# EasyEDA Pro project source.epro, schematic Active_Acoustic_Impedance_Controller_C11_35
Board Name: Active_Acoustic_Impedance_Controller_C11_35; Create Date: 2026-06-30; Page Name: Active_Acoustic_Impedance_Controller_C11_35; Project Name: 正弦电阻V4; Schematic Name: Active_Acoustic_Impedance_Controller_C11_35; Update Date: 2026-07-03; File: Active_Acoustic_Impedance_Controller_C11_35; Id: /; Sheet: /
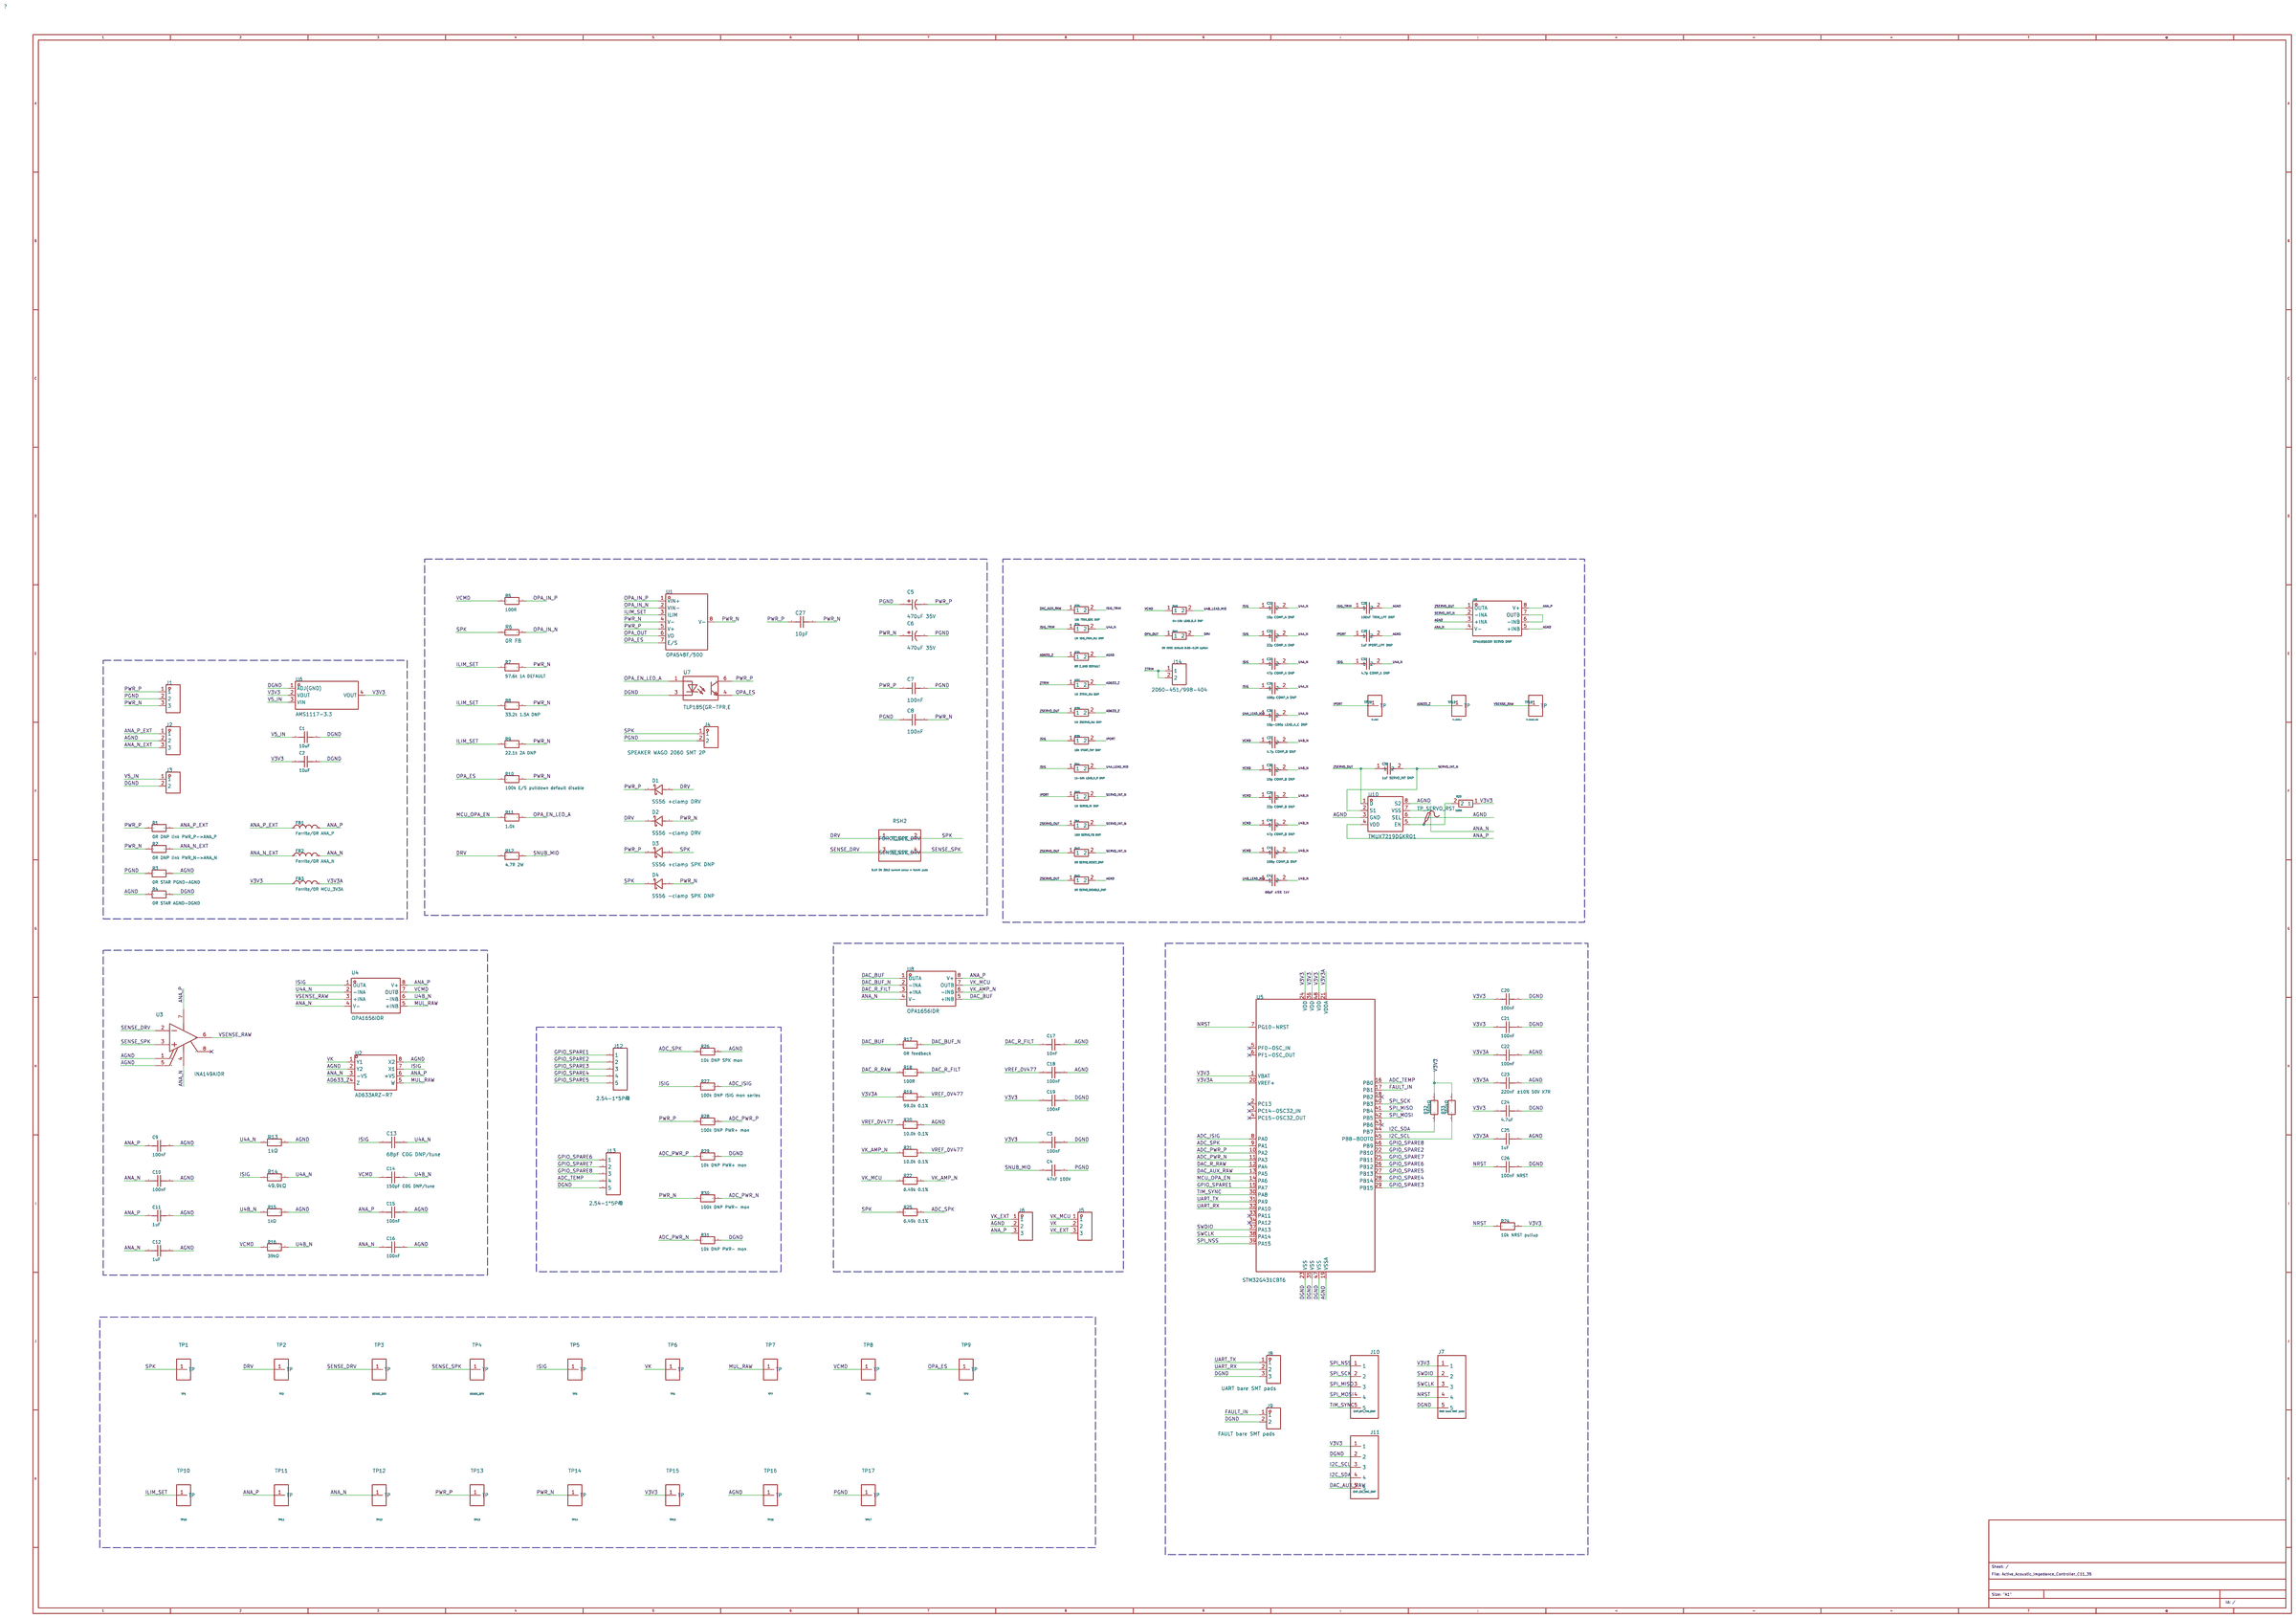
[diagram p0: schematic sheet]

## Parts
C1  10uF  [C0805]
C2  10uF  [C0805]
C3  100nF  [C0805]
C4  47nF 100V  [C0805]
C5  470uF 35V  [CAP-SMD_BD10.0-L10.3-W10.3-LS11.3-FD]
C6  470uF 35V  [CAP-SMD_BD10.0-L10.3-W10.3-LS11.3-FD]
C7  100nF  [C0805]
C8  100nF  [C0805]
C9  100nF  [C0805]
C10  100nF  [C0805]
C11  1uF  [C0805]
C12  1uF  [C0805]
C13  68pF C0G DNP/tune  [C0805]  (no BOM)
C14  150pF C0G DNP/tune  [C0805]  (no BOM)
C15  100nF  [C0805]
C16  100nF  [C0805]
C17  10nF  [C0805]
C18  100nF  [C0805]
C19  100nF  [C0805]
C20  100nF  [C0805]
C21  100nF  [C0805]
C22  100nF  [C0805]
C23  220nF ±10% 50V X7R  [C0805]
C24  4.7uF  [C0805]
C25  1uF  [C0805]
C26  100nF NRST  [C0805]
C27  10pF  [C0805]
C28  100nF TRIM_LPF DNP  [C0805]
C29  1uF IPORT_LPF DNP  [C0805]
C30  1uF SERVO_INT DNP  [C0805]
C31  4.7p COMP_A DNP  [C0805]
C32  10p COMP_A DNP  [C0805]
C33  22p COMP_A DNP  [C0805]
C34  47p COMP_A DNP  [C0805]
C35  100p COMP_A DNP  [C0805]
C36  10p-100p LEAD_A_C DNP  [C0805]
C37  4.7p COMP_B DNP  [C0805]
C38  10p COMP_B DNP  [C0805]
C39  22p COMP_B DNP  [C0805]
C40  47p COMP_B DNP  [C0805]
C41  100p COMP_B DNP  [C0805]
C42  10p-100p LEAD_B_C DNP  [C0805]
D1  SS56 +clamp DRV  [SMB_L4.3-W3.6-LS5.4-RD]
D2  SS56 -clamp DRV  [SMB_L4.3-W3.6-LS5.4-RD]
D3  SS56 +clamp SPK DNP  [SMB_L4.3-W3.6-LS5.4-RD]  (no BOM)
D4  SS56 -clamp SPK DNP  [SMB_L4.3-W3.6-LS5.4-RD]  (no BOM)
FB1  Ferrite/0R ANA_P  [L0805]
FB2  Ferrite/0R ANA_N  [L0805]
FB3  Ferrite/0R MCU_3V3A  [L0805]
J1  2060-453/998-404  [CONN-SMD_2060-453]
J2  2060-453/998-404  [CONN-SMD_2060-453]
J3  2060-452/998-404  [CONN-SMD_2060-452]
J4  SPEAKER WAGO 2060 SMT 2P  [CONN-SMD_2060-452]
J5  2060-453/998-404  [CONN-SMD_2060-453]
J6  2060-453/998-404  [CONN-SMD_2060-453]
J7  SWD bare SMT pads  [AAI_C11_35_LOCAL_Footprints:AAI_PinHeader_1x05_P1_27mm_Vertical]  (no BOM)
J8  UART bare SMT pads  [CONN-SMD_2060-453]
J9  FAULT bare SMT pads  [CONN-SMD_2060-452]
J10  EXP_SPI_TIM_DNP  [AAI_C11_35_LOCAL_Footprints:AAI_PinHeader_1x05_P2_54mm_Vertical]  (no BOM)
J11  EXP_I2C_DAC_DNP  [AAI_C11_35_LOCAL_Footprints:AAI_PinHeader_1x05_P2_54mm_Vertical]  (no BOM)
J12  2.54-1*5P母  [HDR-TH_5P-P2.54-V-F]
J13  2.54-1*5P母  [HDR-TH_5P-P2.54-V-F]
J14  2060-451/998-404  [CONN-SMD_L12.7-W3.9_2060-451-998-404]
R1  0R DNP link PWR_P->ANA_P  [R0805]  (no BOM)
R2  0R DNP link PWR_N->ANA_N  [R0805]  (no BOM)
R3  0R STAR PGND-AGND  [R0805]
R4  0R STAR AGND-DGND  [R0805]
R5  100R  [R0805]
R6  0R FB  [R0805]
R7  57.6k 1A DEFAULT  [R0805]
R8  33.2k 1.5A DNP  [R0805]  (no BOM)
R9  22.1k 2A DNP  [R0805]  (no BOM)
R10  100k E/S pulldown default disable  [R0805]
R11  1.0k  [R0805]
R12  4.7R 2W  [R0805]
R13  1kΩ  [R0805]
R14  49.9kΩ  [R0805]
R15  1kΩ  [R0805]
R16  39kΩ  [R0805]
R17  0R feedback  [R0805]
R18  100R  [R0805]
R19  59.0k 0.1%  [R0805]
R20  10.0k 0.1%  [R0805]
R21  10.0k 0.1%  [R0805]
R22  6.49k 0.1%  [R0805]
R23  100K  [R0805]
R24  10k NRST pullup  [R0805]
R25  6.49k 0.1%  [R0805]  (no BOM)
R26  10k DNP SPK mon  [R0805]  (no BOM)
R27  100k DNP ISIG mon series  [R0805]  (no BOM)
R28  100k DNP PWR+ mon  [R0805]  (no BOM)
R29  10k DNP PWR+ mon  [R0805]  (no BOM)
R30  100k DNP PWR- mon  [R0805]  (no BOM)
R31  10k DNP PWR- mon  [R0805]
R32  360kΩ  [R0805]  (no BOM)
R33  360kΩ  [R0805]  (no BOM)
R34  1M ISIG_TRIM_INJ DNP  [R0805]
R35  10k TRIM_SRC DNP  [R0805]
R36  0R Z_GND DEFAULT  [R0805]
R37  1M ZTRIM_INJ DNP  [R0805]
R38  1M ZSERVO_INJ DNP  [R0805]
R39  10k IPORT_TAP DNP  [R0805]
R40  1M SERVO_IN DNP  [R0805]
R41  10M SERVO_FB DNP  [R0805]
R42  0R SERVO_RESET_DNP  [R0805]
R43  0R SERVO_DISABLE_DNP  [R0805]
R44  1k-10k LEAD_A_R DNP  [R0805]
R45  1k-10k LEAD_B_R DNP  [R0805]
R46  0R RISO default 0.05-0.2R option  [R0805]
RSH2  0.1R 3W 2512 current sense + Kelvin pads  [AAI_C11_35_LOCAL_Footprints:AAI_SHUNT_4T_3920_Kelvin]
TP1  TP1  [AAI_C11_35_LOCAL_Footprints:AAI_TestPoint_THTPad_D1_5mm_Drill0_7mm]  (no BOM)
TP2  TP2  [AAI_C11_35_LOCAL_Footprints:AAI_TestPoint_THTPad_D1_5mm_Drill0_7mm]  (no BOM)
TP3  SENSE_DRV  [AAI_C11_35_LOCAL_Footprints:AAI_TestPoint_THTPad_D1_5mm_Drill0_7mm]  (no BOM)
TP4  SENSE_SPK  [AAI_C11_35_LOCAL_Footprints:AAI_TestPoint_THTPad_D1_5mm_Drill0_7mm]  (no BOM)
TP5  TP5  [AAI_C11_35_LOCAL_Footprints:AAI_TestPoint_THTPad_D1_5mm_Drill0_7mm]  (no BOM)
TP6  TP6  [AAI_C11_35_LOCAL_Footprints:AAI_TestPoint_THTPad_D1_5mm_Drill0_7mm]  (no BOM)
TP7  TP7  [AAI_C11_35_LOCAL_Footprints:AAI_TestPoint_THTPad_D1_5mm_Drill0_7mm]  (no BOM)
TP8  TP8  [AAI_C11_35_LOCAL_Footprints:AAI_TestPoint_THTPad_D1_5mm_Drill0_7mm]  (no BOM)
TP9  TP9  [AAI_C11_35_LOCAL_Footprints:AAI_TestPoint_THTPad_D1_5mm_Drill0_7mm]  (no BOM)
TP10  TP10  [AAI_C11_35_LOCAL_Footprints:AAI_TestPoint_THTPad_D1_5mm_Drill0_7mm]  (no BOM)
TP11  TP11  [AAI_C11_35_LOCAL_Footprints:AAI_TestPoint_THTPad_D1_5mm_Drill0_7mm]  (no BOM)
TP12  TP12  [AAI_C11_35_LOCAL_Footprints:AAI_TestPoint_THTPad_D1_5mm_Drill0_7mm]  (no BOM)
TP13  TP13  [AAI_C11_35_LOCAL_Footprints:AAI_TestPoint_THTPad_D1_5mm_Drill0_7mm]  (no BOM)
TP14  TP14  [AAI_C11_35_LOCAL_Footprints:AAI_TestPoint_THTPad_D1_5mm_Drill0_7mm]  (no BOM)
TP15  TP15  [AAI_C11_35_LOCAL_Footprints:AAI_TestPoint_THTPad_D1_5mm_Drill0_7mm]  (no BOM)
TP16  TP16  [AAI_C11_35_LOCAL_Footprints:AAI_TestPoint_THTPad_D1_5mm_Drill0_7mm]  (no BOM)
TP17  TP17  [AAI_C11_35_LOCAL_Footprints:AAI_TestPoint_THTPad_D1_5mm_Drill0_7mm]  (no BOM)
TP18  TP_VSENSE_RAW  [AAI_C11_35_LOCAL_Footprints:AAI_TestPoint_THTPad_D1_5mm_Drill0_7mm]  (no BOM)
TP19  TP_AD633_Z  [AAI_C11_35_LOCAL_Footprints:AAI_TestPoint_THTPad_D1_5mm_Drill0_7mm]  (no BOM)
TP20  TP_IPORT  [AAI_C11_35_LOCAL_Footprints:AAI_TestPoint_THTPad_D1_5mm_Drill0_7mm]  (no BOM)
TP_SERVO_RST  -  [Test-Point-0.5mm]
U1  OPA548F/500  [TO-263-7_L10.2-W10.4-P1.27-LS14.4-TL]
U2  AD633ARZ-R7  [SOIC-8_L4.9-W3.9-P1.27-LS6.0-BL]
U3  INA149AIDR  [SOIC-8_L4.9-W3.9-P1.27-LS6.0-BL]
U4  OPA1656IDR  [SOIC-8_L4.9-W3.9-P1.27-LS6.0-BL]
U5  STM32G431CBT6  [LQFP-48_L7.0-W7.0-P0.50-LS9.0-BL]
U6  AMS1117-3.3  [SOT-223-3_L6.5-W3.4-P2.30-LS7.0-BR]
U7  TLP185(GR-TPR,E  [SOP-6_4P-L3.7-W4.6-P2.54-LS7.0-BL]
U8  OPA1656IDR  [SOIC-8_L4.9-W3.9-P1.27-LS6.0-BL]
U9  OPA1656IDR SERVO DNP  [SOIC-8_L4.9-W3.9-P1.27-LS6.0-BL]  (no BOM)
U10  TMUX7219DGKRQ1  [VSSOP-8_L3.0-W3.0-P0.65-LS4.9-BL]

## Library data of the parts
C1 C2 = AC0805KKX5R9BB225: 容值:2.2uF;精度:±10%;额定电压:50V;温度系数:X5R;; LCSC Part Name: 2.2uF ±10% 50V; Supplier Part: C3849516; Manufacturer: YAGEO(国巨); Supplier Footprint: 0805; JLCPCB Part Class: 扩展库; Datasheet: https://item.szlcsc.com/datasheet/AC0805KKX5R9BB225/4418002.html; Supplier: LCSC; Tolerance: ±10%; Voltage Rating: 50V; Temperature Coefficient: X5R
C3 C4 C17-C19 = CL21A106KAYNNNG: 容值:10uF;精度:±10%;额定电压:25V;温度系数:X5R;; LCSC Part Name: 10uF ±10% 25V; Supplier Part: C318691; Manufacturer: SAMSUNG(三星); Supplier Footprint: 0805; JLCPCB Part Class: 扩展库; Supplier: LCSC; Tolerance: ±10%; Voltage Rating: 25V; Temperature Coefficient: X5R
C5 C6 = XT470UF35V90RV0080: 容值:470uF;精度:±20%;额定电压:35V;纹波电流:310mA@120Hz;等效串联电阻(ESR):-;; LCSC Part Name: 470uF ±20% 35V; Supplier Part: C2992611; Manufacturer: KNSCHA(科尼盛); Supplier Footprint: SMD,D10xL10.5mm; JLCPCB Part Class: 扩展库; Datasheet: https://item.szlcsc.com/datasheet/XT470UF35V90RV0080/3457671.html; Supplier: LCSC; Tolerance: ±20%; Voltage Rating: 35V; Ripple Current: 310mA@120Hz; Diameter: 10mm; Height - Seated (Max): 10.5mm; Lifetime: 2000hrs@105℃; Operating Temperature: -55℃~+105℃
C7 C8 = CC0805KRX7R9BB104: 容值:100nF;精度:±10%;额定电压:50V;温度系数:X7R;; LCSC Part Name: 100nF ±10% 50V; Supplier Part: C49678; Manufacturer: YAGEO(国巨); Supplier Footprint: 0805; JLCPCB Part Class: 基础库; Datasheet: https://item.szlcsc.com/datasheet/CC0805KRX7R9BB104/50686.html; Supplier: LCSC; Tolerance: ±10%; Voltage Rating: 50V; Temperature Coefficient: X7R
C9 C10 C14-C16 = CSA0805X7R104K201MT: 容值:100nF;精度:±10%;额定电压:200V;温度系数:X7R;; LCSC Part Name: 100nF ±10% 200V; Supplier Part: C54177994; Manufacturer: HRE(芯声); Supplier Footprint: 0805; JLCPCB Part Class: 扩展库; Datasheet: https://item.szlcsc.com/datasheet/CSA0805X7R104K201MT/57424607.html; Supplier: LCSC; Tolerance: ±10%; Voltage Rating: 200V; Temperature Coefficient: X7R
C11 C12 = C0805Y5V250-105ZNE: 容值:1uF;精度:-20%~+80%;额定电压:25V;温度系数:Y5V;; LCSC Part Name: 1uF -20%~+80% 25V; Supplier Part: C3907177; Manufacturer: Venkel; Supplier Footprint: 0805; JLCPCB Part Class: 扩展库; Datasheet: https://item.szlcsc.com/datasheet/C0805Y5V250-105ZNE/4475709.html; Supplier: LCSC; Tolerance: -20%~+80%; Voltage Rating: 25V; Temperature Coefficient: Y5V
C13 = FV21N680J102ECG: 容值:68pF;精度:±5%;额定电压:1kV;温度系数:C0G;; LCSC Part Name: 68pF ±5% 1kV; Supplier Part: C565680; Manufacturer: PSA(信昌电陶); Supplier Footprint: 0805; JLCPCB Part Class: 扩展库; Datasheet: https://item.szlcsc.com/datasheet/FV21N680J102ECG/591162.html; Supplier: LCSC; Tolerance: ±5%; Voltage Rating: 1kV; Temperature Coefficient: C0G
C20-C26 = CL21B224KCQVPNE: 容值:220nF;精度:±10%;额定电压:100V;温度系数:X7R;; LCSC Part Name: 220nF ±10% 100V; Supplier Part: C2976447; Manufacturer: SAMSUNG(三星); Supplier Footprint: 0805; JLCPCB Part Class: 扩展库; Datasheet: https://item.szlcsc.com/datasheet/CL21B224KCQVPNE/3382911.html; Supplier: LCSC; Tolerance: ±10%; Voltage Rating: 100V; Temperature Coefficient: X7R
C27 = 0805CG100J501NT: 容值:10pF;精度:±5%;额定电压:500V;温度系数:C0G;; LCSC Part Name: 10pF ±5% 500V; Supplier Part: C49307532; Manufacturer: FH(风华); Supplier Footprint: 0805; JLCPCB Part Class: 扩展库; Datasheet: https://item.szlcsc.com/datasheet/0805CG100J501NT/51771081.html; Supplier: LCSC; Tolerance: ±5%; Voltage Rating: 500V; Temperature Coefficient: C0G
C28-C42 = ProPrj_正弦电-easyedapro_FV21N680J102ECG: UserDocLink: https://item.szlcsc.com/datasheet/FV21N680J102ECG/591162.html; Manufacturer Part: FV21N680J102ECG; Manufacturer: PSA(信昌电陶); Supplier Part: C565680; Supplier: LCSC; LCSC Part Name: 68pF ±5% 1kV
D1-D4 = SS56: Supplier Part: C9900018665; Supplier Footprint: SMB; JLCPCB Part Class: 扩展库; Supplier: LCSC
FB1-FB3 = MLB2012F-151T: 阻抗@频率:150Ω@100MHz;误差:±25%;直流电阻(DCR):200mΩ;; LCSC Part Name: 单路 0805磁珠 阻抗150Ω@100MHz; Supplier Part: C2844589; Manufacturer: MetalLions(美铼); Supplier Footprint: 0805; JLCPCB Part Class: 扩展库; Datasheet: https://item.szlcsc.com/datasheet/MLB2012F-151T/3035854.html; Supplier: LCSC; Impedance @ Frequency: 150Ω@100MHz; Tolerance: ±25%; DC Resistance(DCR): 200mΩ; Current Rating: 400mA; Number of Circuits: 1; Operating Temperature: -55℃~+125℃
J1 J2 J5 J6 J8 = 2060-453/998-404: 结构:1x3P;间距:4mm;颜色:白色;安装方式:-;总PIN数:3P;每排PIN数:3;排数:1;额定电流:9A;额定电压:320V;线规 - AWG:18~24;线规 - 平方毫米:-;工作温度:-60℃~+105℃;; LCSC Part Name: 1x3P 4mm 每排P数:3 排数:1; Supplier Part: C2765056; Manufacturer: WAGO(万可); Supplier Footprint: SMD,P=4mm; JLCPCB Part Class: 扩展库; Datasheet: https://item.szlcsc.com/datasheet/2060-453%252F998-404/2901157.html; Supplier: LCSC; Number of Positions or Pins: 1x3P; Pitch: 4mm; Color: 白色; Number of Pins: 3P; Number of PINs Per Row: 3; Number of Rows: 1; Current Rating: 9A; Voltage Rating (Max): 320V; Wire Gauge - AWG: 18~24; Operating Temperature: -60℃~+105℃
J3 J4 J9 = 2060-452/998-404: 结构:1x2P;间距:4mm;颜色:白色;安装方式:-;总PIN数:2P;每排PIN数:2;排数:1;额定电流:9A;额定电压:320V;线规 - AWG:18~24;线规 - 平方毫米:-;工作温度:-60℃~+105℃;; LCSC Part Name: 1x2P 4mm 每排P数:2 排数:1; Supplier Part: C2765055; Manufacturer: WAGO(万可); Supplier Footprint: SMD,P=4mm; JLCPCB Part Class: 扩展库; Datasheet: https://item.szlcsc.com/datasheet/2060-452%252F998-404/2901156.html; Supplier: LCSC; Number of Positions or Pins: 1x2P; Pitch: 4mm; Color: 白色; Number of Pins: 2P; Number of PINs Per Row: 2; Number of Rows: 1; Current Rating: 9A; Voltage Rating (Max): 320V; Wire Gauge - AWG: 18~24; Operating Temperature: -60℃~+105℃
J7 = AAI_CONN_01X05: Mount: PAD; JLCPCB_Assembly: NO; Assembly_Risk: HAND; Assembly_Note: Excluded from JLC SMT BOM/CPL; hand solder.
J10 J11 = AAI_CONN_01X05
J12 J13 = 2.54-1*5P母: 插孔结构:1x5P;间距:2.54mm;行距:-;圆孔/方孔:方孔;安装方式:直插;排数:单排;总孔位数:5P;额定电流:3A;插孔方向:顶部;塑高:8.5mm;触头材质:黄铜;触头镀层:金;工作温度:-55℃~+105℃;; LCSC Part Name: 1x5P 间距:2.54mm 直插; Supplier Part: C50950; Manufacturer: BOOMELE(博穆精密); Supplier Footprint: 插件,P=2.54mm; JLCPCB Part Class: 扩展库; Datasheet: https://item.szlcsc.com/datasheet/2.54-1*5P%25E6%25AF%258D/51962.html; Supplier: LCSC; Holes Structure: 1x5P; Pitch: 2.54mm; Circular Hole / Square Hole: 方孔; Mounting Type: 直插; Number of Rows: 单排; Number of Positions: 5P; Current Rating: 3A; Holes Direction: 顶部; Insulation Height: 8.5mm; Contact Material: 黄铜; Contact Plating: 金; Operating Temperature: -55℃~+105℃; PIN Length: 3.2mm
J14 = 2060-451/998-404: 结构:1x1P;间距:-;颜色:白色;安装方式:卧贴;总PIN数:1P;每排PIN数:1;排数:1;额定电流:9A;额定电压:600V;线规 - AWG:18~24;线规 - 平方毫米:0.2~0.75;工作温度:-60℃~+105℃;; LCSC Part Name: 1x1P 每排P数:1 排数:1; Supplier Part: C2765054; Manufacturer: WAGO(万可); Supplier Footprint: SMD,P=4mm; JLCPCB Part Class: Extended Part; Datasheet: https://item.szlcsc.com/datasheet/2060-451%252F998-404/2901155.html; Supplier: LCSC; Number of Positions or Pins: 1x1P; Color: 白色; Mounting Type: 卧贴; Number of Pins: 1P; Number of PINs Per Row: 1; Number of Rows: 1; Current Rating: 9A; Voltage Rating (Max): 600V; Wire Gauge - AWG: 18~24; Wire Gauge - mm2: 0.2~0.75; Operating Temperature: -60℃~+105℃
R1-R5 R7-R11 = MCU08050D1000BP100: 电阻类型:薄膜电阻;阻值:100Ω;精度:±0.1%;功率:125mW;温度系数:±25ppm/℃;; LCSC Part Name: 薄膜电阻 100Ω ±0.1% 125mW; Supplier Part: C4277626; Manufacturer: VISHAY(威世); Supplier Footprint: 0805; JLCPCB Part Class: 扩展库; Datasheet: https://item.szlcsc.com/datasheet/MCU08050D1000BP100/4848059.html; Supplier: LCSC; Type: 薄膜电阻; Tolerance: ±0.1%; Power(Watts): 125mW; Temperature Coefficient: ±25ppm/℃; Operating Temperature: -55℃~+125℃
R6 = 0805W8F0000T5E: 电阻类型:厚膜电阻;阻值:0Ω;精度:±1%;功率:125mW;工作电压:150V;温度系数:±800ppm/℃;; LCSC Part Name: 0Ω ±1% 125mW 厚膜电阻; Supplier Part: C17477; Manufacturer: UNI-ROYAL(厚声); Supplier Footprint: 0805; JLCPCB Part Class: 基础库; Datasheet: https://item.szlcsc.com/datasheet/0805W8F0000T5E/18165.html; Supplier: LCSC; Type: 厚膜电阻; Tolerance: ±1%; Power(Watts): 125mW; Voltage-Supply(Max): 150V; Temperature Coefficient: ±800ppm/℃; Operating Temperature: -55℃~+155℃
R12 = RE2512F3R002: 电阻类型:采样电阻；合金电阻;阻值:2mΩ;精度:±1%;功率:3W;温度系数:±100ppm/℃;安装方式:贴片;; LCSC Part Name: 2mΩ 3W 2512 ±1%; Supplier Part: C46961747; Manufacturer: JIERR(捷而瑞); Supplier Footprint: 2512; JLCPCB Part Class: 扩展库; Datasheet: https://item.szlcsc.com/datasheet/RE2512F3R002/49133286.html; Supplier: LCSC; Type: 采样电阻；合金电阻; Tolerance: ±1%; Power(Watts): 3W; Temperature Coefficient: ±100ppm/℃; Mounting Type: 贴片
R13 = THE05G1001FT: 电阻类型:薄膜电阻;阻值:1kΩ;精度:±1%;功率:125mW;工作电压:150V;温度系数:±25ppm/℃;; LCSC Part Name: 薄膜电阻 1kΩ ±1% 125mW; Supplier Part: C47120038; Manufacturer: FH(风华); Supplier Footprint: 0805; JLCPCB Part Class: 扩展库; Datasheet: https://item.szlcsc.com/datasheet/THE05G1001FT/49315440.html; Supplier: LCSC; Type: 薄膜电阻; Tolerance: ±1%; Power(Watts): 125mW; Voltage-Supply(Max): 150V; Temperature Coefficient: ±25ppm/℃; Operating Temperature: -55℃~+155℃
R14 = CR0805-FX-4992ELF: 电阻类型:厚膜电阻;阻值:49.9kΩ;精度:±1%;功率:125mW;工作电压:150V;温度系数:±100ppm/℃;; LCSC Part Name: 厚膜电阻 49.9kΩ ±1% 125mW; Supplier Part: C49674927; Manufacturer: BOURNS; Supplier Footprint: 0805; JLCPCB Part Class: 扩展库; Datasheet: https://item.szlcsc.com/datasheet/CR0805-FX-4992ELF/52234561.html; Supplier: LCSC; Type: 厚膜电阻; Tolerance: ±1%; Power(Watts): 125mW; Voltage-Supply(Max): 150V; Temperature Coefficient: ±100ppm/℃; Operating Temperature: -55℃~+155℃
R15 R16 = CL0805FN1KPS: 电阻类型:厚膜电阻;阻值:1kΩ;精度:±1%;功率:125mW;工作电压:150V;; LCSC Part Name: 厚膜电阻 1kΩ 125mW; Supplier Part: C50397095; Manufacturer: 昶龙科技; Supplier Footprint: 0805; JLCPCB Part Class: 扩展库; Datasheet: https://item.szlcsc.com/datasheet/CL0805FN1KPS/53023051.html; Supplier: LCSC; Type: 厚膜电阻; Tolerance: ±1%; Power(Watts): 125mW; Voltage-Supply(Max): 150V; Operating Temperature: -55℃~+70℃
R17-R22 R25-R31 = CL0805JN1R6PS: 电阻类型:厚膜电阻;阻值:1.6Ω;精度:±5%;功率:125mW;工作电压:150V;; LCSC Part Name: 厚膜电阻 1.6Ω ±5% 125mW; Supplier Part: C52209841; Manufacturer: 昶龙科技; Supplier Footprint: 0805; JLCPCB Part Class: 扩展库; Datasheet: https://item.szlcsc.com/datasheet/CL0805JN1R6PS/55057632.html; Supplier: LCSC; Type: 厚膜电阻; Tolerance: ±5%; Power(Watts): 125mW; Voltage-Supply(Max): 150V; Operating Temperature: -55℃~+70℃
R23 R34-R46 = ProPrj_正弦电-easyedapro_MCU08050D1000BP100: UserDocLink: https://item.szlcsc.com/datasheet/MCU08050D1000BP100/4848059.html; Manufacturer Part: MCU08050D1000BP100; Manufacturer: VISHAY(威世); Supplier Part: C4277626; Supplier: LCSC; LCSC Part Name: 薄膜电阻 100Ω ±0.1% 125mW
R24 = CL0805FN2R4PS: 电阻类型:厚膜电阻;阻值:2.4Ω;精度:±1%;功率:125mW;工作电压:150V;; LCSC Part Name: 厚膜电阻 2.4Ω 125mW; Supplier Part: C50397122; Manufacturer: 昶龙科技; Supplier Footprint: 0805; Datasheet: https://item.szlcsc.com/datasheet/CL0805FN2R4PS/53023078.html; Supplier: LCSC; Type: 厚膜电阻; Tolerance: ±1%; Power(Watts): 125mW; Voltage-Supply(Max): 150V; Operating Temperature: -55℃~+70℃
R32 R33 = CL0805FN360KPS: 电阻类型:厚膜电阻;阻值:360kΩ;精度:±1%;功率:125mW;工作电压:150V;温度系数:±100ppm/℃;; LCSC Part Name: 厚膜电阻 360kΩ ±1% 125mW; Supplier Part: C48391928; Manufacturer: 昶龙科技; Supplier Footprint: 0805; JLCPCB Part Class: 扩展库; Datasheet: https://item.szlcsc.com/datasheet/CL0805FN360KPS/50640511.html; Supplier: LCSC; Type: 厚膜电阻; Tolerance: ±1%; Power(Watts): 125mW; Voltage-Supply(Max): 150V; Temperature Coefficient: ±100ppm/℃; Operating Temperature: -55℃~+70℃
RSH2 = AAI_SHUNT_4T: Attribute1: KELVIN; LCSC: C2903476; JLCPCB Part #: C2903476; MPN: HoJLR2512-3W-100mR-1%; Manufacturer: Milliohm; JLC Package: 2512; Mount: SMT; JLCPCB_Assembly: YES; Assembly_Risk: HAND; Assembly_Note: Excluded from JLC SMT BOM/CPL; hand solder.
TP1-TP17 = AAI_TESTPOINT: Mount: PAD; JLCPCB_Assembly: NO; Assembly_Risk: HAND; Assembly_Note: Excluded from JLC SMT BOM/CPL; hand solder.
TP18-TP20 = ProPrj_正弦电-easyedapro_AAI_TESTPOINT
TP_SERVO_RST = Test-Point: Test Point 测试点
U1 = OPA548F/500: 放大器数:1;轨到轨:-;增益带宽积(GBW):1MHz;输入失调电压(Vos):10mV;压摆率(SR):10V/us;输入偏置电流(Ib):500nA;; LCSC Part Name: 高压、大电流运算放大器; Supplier Part: C527496; Manufacturer: TI(德州仪器); Supplier Footprint: TO-263-7; JLCPCB Part Class: 扩展库; Datasheet: https://www.ti.com/cn/lit/gpn/opa548; Supplier: LCSC; Number of Channels: 1; Maximum Power Supply Range (Vdd-Vss): 60V; Gain Bandwidth Product: 1MHz; Vos - Input Offset Voltage: 10mV; Input Offset Voltage Drift(Vos TC): 30uV/℃; Slew Rate: 10V/us; Ib - Input Bias Current: 500nA; Input Offset Current(Ios): 50nA; Input Voltage Noise Density: 90nV/√Hz@1kHz; Common Mode Rejection Ratio(CMRR): 95dB; Quiescent Current: 20mA; Output Current: 3A; Operating Temperature: -40℃~+85℃; Single supply: 8V~60V; Dual Supply: 4V~30V；-30V~-4V
U2 = AD633ARZ-R7: 象限:四象限;压摆率(SR):20V/us;带宽:1MHz;; LCSC Part Name: 四象限模拟乘法器; Supplier Part: C77810; Manufacturer: ADI(亚德诺); Supplier Footprint: SOIC-8; JLCPCB Part Class: 扩展库; Datasheet: https://item.szlcsc.com/datasheet/AD633ARZ-R7/78943.html; Supplier: LCSC; Quadrant: 四象限; Slew Rate: 20V/us; Bandwidth: 1MHz; Voltage - Supply: -8V~18V; Current - Supply: 5mA; Operating Temperature: -40℃~+85℃
U3 = INA149AIDR: 放大器数:单路;共模抑制比(CMRR):90dB;输入偏置电流(Ib):-;输入失调电压(Vos):350uV;增益带宽积(GBP):-;压摆率(SR):5V/us;带宽(-3db):500kHz;轨到轨:轨到轨输出;; LCSC Part Name: 高共模电压差分放大器; Supplier Part: C183089; Manufacturer: TI(德州仪器); Supplier Footprint: SOIC-8; JLCPCB Part Class: 扩展库; Datasheet: https://www.ti.com/cn/lit/gpn/ina149; Supplier: LCSC; Number of Channels: 单路; Common Mode Rejection Ratio(CMRR): 90dB; Vos - Input Offset Voltage: 350uV; Slew Rate: 5V/us; Voltage - Supply: 2V~18V；-18V~-2V; -3dB Bandwidth: 500kHz; Rail to Rail: 轨到轨输出; Input Offset Voltage Drift(Vos TC): 3uV/℃; Operating Temperature: -40℃~+125℃
U4 U8 = OPA1656IDR: OPA1656 SoundPlus™ 超低噪声和失真、Burr-Brown™ 音频运算放大器; LCSC Part Name: 超低噪声、低失真、FET输入音频运算放大器; Supplier Part: C1849431; Manufacturer: TI(德州仪器); Supplier Footprint: SOIC-8; JLCPCB Part Class: 扩展库; Datasheet: https://www.ti.com/cn/lit/gpn/opa1656; Supplier: LCSC
U5 = STM32G431CBT6: CPU内核:ARM-M系列;CPU最大主频:170MHz;应用领域:-;; LCSC Part Name: 带DSP和FPU的170MHz主流ARM Cortex-M4 MCU，具有128 KB Flash存储器、数学加速器和中等模拟电平集成; Supplier Part: C529355; Manufacturer: ST(意法半导体); Supplier Footprint: LQFP-48(7x7); JLCPCB Part Class: 扩展库; Datasheet: https://item.szlcsc.com/datasheet/STM32G431CBT6/549633.html; Supplier: LCSC; CPU Core: ARM-M系列; CPU Maximum Speed: 170MHz; Program Storage Size: 128KB; Program Memory Type: FLASH; Number of I/O: 38; ADC (Bit): 12bit; DAC (Bit): 12bit; Voltage - Supply: 1.71V~3.6V
U6 = AMS1117-3.3: 输出极性:正极;工作电压:18V;输出电压:3.3V;输出电流:1A;电源纹波抑制比(PSRR):60dB@(120Hz);输出类型:固定;; LCSC Part Name: 3.3V 1A 18V; Supplier Part: C2891839; Manufacturer: YONGYUTAI(永裕泰); Supplier Footprint: SOT-223-3; JLCPCB Part Class: 扩展库; Datasheet: https://item.szlcsc.com/datasheet/AMS1117-3.3/3119758.html; Supplier: LCSC; Output Configuration: 正极; Voltage - Supply: 18V; Output Voltage: 3.3V; Output Current: 1A; Power Supply Rejection Ratio (PSRR): 60dB@(120Hz); Voltage Dropout: 1.3V@(1A); standby current: 10mA; Noise: 0.005%Vout; Features: 过流保护；热关断; Operating Temperature: -40℃~+125℃@(Tj); Output Type: 固定; Number of Outputs: 1
U7 = TLP185(GR-TPR,E: 输入类型:DC;正向压降(Vf):1.25V;输出电流:50mA;隔离电压(Vrms):3.75kV;直流反向耐压(Vr):5V;负载电压:80V;输出通道数:-;集射极饱和电压(VCE(sat)):300mV@2.4mA,8mA;; LCSC Part Name: DC输入 隔离电压(rms):3750V; Supplier Part: C393884; Manufacturer: TOSHIBA(东芝); Supplier Footprint: SOP-4-2.54mm; JLCPCB Part Class: 扩展库; Datasheet: https://item.szlcsc.com/datasheet/TLP185(GR-TPR%252CE/372595.html; Supplier: LCSC; Input type: DC; Output Type: 光电三极管; Voltage - Forward(Vf): 1.25V; Output Current: 50mA; Isolation Voltage(Vrms): 3.75kV; Reverse Voltage: 5V; Load Voltage: 80V; Vce Saturation(VCE(sat)): 300mV@2.4mA,8mA; Rise time: 5us@2mA,100Ω; Fall time: 9us@2mA,100Ω; Operating Temperature: -55℃~+110℃; Current Transfer Ratio (CTR) Minimum: 100%; Current Transfer Ratio (CTR) Maximum/Saturation Value: 300%; Total Power Dissipation(Pd): 200mW; Forward Current(If): 20mA
U9 = ProPrj_正弦电-easyedapro_OPA1656IDR: UserDocLink: https://www.ti.com/cn/lit/gpn/opa1656; Manufacturer Part: OPA1656IDR; Manufacturer: TI(德州仪器); Supplier Part: C1849431; Supplier: LCSC; LCSC Part Name: 超低噪声、低失真、FET输入音频运算放大器
U10 = TMUX7219DGKRQ1: 开关电路:2:1;通道数:1;导通电阻(Ron):2.8Ω;; LCSC Part Name: 具有1.8V逻辑电平和门锁效应抑制特性的44V 2:1(SPDT)精密开关; Supplier Part: C3658035; Manufacturer: TI(德州仪器); Supplier Footprint: VSSOP-8; JLCPCB Part Class: Extended Part; Datasheet: https://www.ti.com/cn/lit/gpn/tmux7219-q1; Supplier: LCSC; Switch Circuit: 2:1; Number of Channels: 1; Voltage - Supply: 4.5V~44V; Turn-on time: 168ns; Ron: 2.8Ω; Turn-off time: 180ns

## Nets
AGND: C9.2 C10.2 C11.2 C12.2 C15.2 C16.2 C17.2 C18.2 C22.2 C23.2 C25.2 C28.2 C29.2 J2.2 J6.2 R3.2 R4.1 R13.2 R15.2 R20.2 R26.2 R36.2 R43.2 TP16.1(TP) U2.2(Y2) U2.8(X2) U3.1(REFB) U3.5(REFA) U5.19(VSSA) U9.3(+INA) U9.5(+INB) U10.3(GND) U10.6(SEL) U10.8(S2)
DGND: C1.2 C2.2 C3.2 C19.2 C20.2 C21.2 C24.2 C26.2 J3.2 J7.5 J8.3 J9.2 J11.2 J13.5 R4.2 R29.2 R31.2 U5.23(VSS) U5.35(VSS) U5.47(VSS) U6.1(ADJ(GND)) U7.3(CAT)
PGND: C4.2 C5.1 C6.2 C7.2 C8.1 J1.2 J4.2 R3.1 TP17.1(TP)
V3V3: C2.1 C3.1 C19.1 C20.1 C21.1 C24.1 FB3.1 J7.1 J11.1 R23.1 R24.2 R32.2 R33.2 TP15.1(TP) U5.1(VBAT) U5.24(VDD) U5.36(VDD) U5.48(VDD) U6.2(VOUT) U6.4(VOUT)
V3V3A: C22.1 C23.1 C25.1 FB3.2 R19.1 U5.20(VREF+) U5.21(VDDA)
V5_IN: C1.1 J3.1 U6.3(VIN)
AD633_Z: R36.1 R37.2 R38.2 TP19.1(TP) U2.4(Z)
ADC_ISIG: R27.2 U5.8(PA0)
ADC_PWR_N: R30.2 R31.1 U5.11(PA3)
ADC_PWR_P: R28.2 R29.1 U5.10(PA2)
ADC_SPK: R25.2 R26.1 U5.9(PA1)
ADC_TEMP: J13.4 U5.16(PB0)
ANA_N: C10.1 C12.1 C16.1 FB2.2 TP12.1(TP) U2.3(-VS) U3.4(V-) U4.4(V-) U8.4(V-) U9.4(V-) U10.7(VSS)
ANA_N_EXT: FB2.1 J2.3 R2.2
ANA_P: C9.1 C11.1 C15.1 FB1.2 J6.3 TP11.1(TP) U2.6(+VS) U3.7(V+) U4.8(V+) U8.8(V+) U9.8(V+) U10.4(VDD)
ANA_P_EXT: FB1.1 J2.1 R1.2
DAC_AUX_RAW: J11.5 R35.1 U5.13(PA5)
DAC_BUF: R17.1 U8.1(OUTA) U8.5(+INB)
DAC_BUF_N: R17.2 U8.2(-INA)
DAC_R_FILT: C17.1 R18.2 U8.3(+INA)
DAC_R_RAW: R18.1 U5.12(PA4)
DRV: D1.2(A) D2.1(K) R12.1 R46.2 RSH2.1(FORCE_DRV) TP2.1(TP)
FAULT_IN: J9.1 U5.17(PB1)
GPIO_SPARE1: J12.1 U5.15(PA7)
GPIO_SPARE2: J12.2 U5.22(PB10)
GPIO_SPARE3: J12.3 U5.29(PB15)
GPIO_SPARE4: J12.4 U5.28(PB14)
GPIO_SPARE5: J12.5 U5.27(PB13)
GPIO_SPARE6: J13.1 U5.26(PB12)
GPIO_SPARE7: J13.2 U5.25(PB11)
GPIO_SPARE8: J13.3 U5.46(PB9)
I2C_SCL: J11.3 R33.1 U5.45(PB8-BOOT0)
I2C_SDA: J11.4 R32.1 U5.44(PB7)
ILIM_SET: R7.1 R8.1 R9.1 TP10.1(TP) U1.3(ILIM)
IPORT: C29.1 R39.2 R40.1 TP20.1(TP)
ISIG: C13.1 C31.1 C32.1 C33.1 C34.1 C35.1 R14.1 R27.1 R39.1 R44.1 TP5.1(TP) U2.7(X1) U4.1(OUTA)
ISIG_TRIM: C28.1 R34.1 R35.2
MCU_OPA_EN: R11.1 U5.14(PA6)
MUL_RAW: TP7.1(TP) U2.5(W) U4.5(+INB)
NRST: C26.1 J7.4 R24.1 U5.7(PG10-NRST)
OPA_EN_LED_A: R11.2 U7.1(AN)
OPA_ES: R10.1 TP9.1(TP) U1.7(E/S) U7.4(EMI)
OPA_IN_N: R6.2 U1.2(VIN-)
OPA_IN_P: R5.2 U1.1(VIN+)
OPA_OUT: R46.1 U1.6(VO)
PWR_N: C6.1 C8.2 C27.2 D2.2(A) D4.2(A) J1.3 R2.1 R7.2 R8.2 R9.2 R10.2 R30.1 TP14.1(TP) U1.4(V-) U1.8(V-)
PWR_P: C5.2 C7.1 C27.1 D1.1(K) D3.1(K) J1.1 R1.1 R28.1 TP13.1(TP) U1.5(V+) U7.6(COL)
SENSE_DRV: RSH2.3(SENSE_DRV) TP3.1(TP) U3.2(IN-)
SENSE_SPK: RSH2.4(SENSE_SPK) TP4.1(TP) U3.3(IN+)
SERVO_INT_N: C30.2 R40.2 R41.2 R42.2 U9.2(-INA) U10.2(S1)
SNUB_MID: C4.1 R12.2
SPI_MISO: J10.3 U5.41(PB4)
SPI_MOSI: J10.4 U5.42(PB5)
SPI_NSS: J10.1 U5.39(PA15)
SPI_SCK: J10.2 U5.40(PB3)
SPK: D3.2(A) D4.1(K) J4.1 R6.1 R25.1 RSH2.2(FORCE_SPK) TP1.1(TP)
SWCLK: J7.3 U5.38(PA14)
SWDIO: J7.2 U5.37(PA13)
TIM_SYNC: J10.5 U5.30(PA8)
U4A_LEAD_MID: C36.1 R44.2
U4A_N: C13.2 C31.2 C32.2 C33.2 C34.2 C35.2 C36.2 R13.1 R14.2 R34.2 U4.2(-INA)
U4B_LEAD_MID: C42.1 R45.2
U4B_N: C14.2 C37.2 C38.2 C39.2 C40.2 C41.2 C42.2 R15.1 R16.2 U4.6(-INB)
UART_RX: J8.2 U5.32(PA10)
UART_TX: J8.1 U5.31(PA9)
VCMD: C14.1 C37.1 C38.1 C39.1 C40.1 C41.1 R5.1 R16.1 R45.1 TP8.1(TP) U4.7(OUTB)
VK: J5.2 TP6.1(TP) U2.1(Y1)
VK_AMP_N: R21.1 R22.2 U8.6(-INB)
VK_EXT: J5.3 J6.1
VK_MCU: J5.1 R22.1 U8.7(OUTB)
VREF_0V477: C18.1 R19.2 R20.1 R21.2
VSENSE_RAW: TP18.1(TP) U3.6(VOUT) U4.3(+INA)
ZSERVO_OUT: C30.1 R38.1 R41.1 R42.1 R43.1 U9.1(OUTA) U10.1(D)
ZTRIM: J14.1 J14.2 R37.1
$1N56724: U9.6(-INB) U9.7(OUTB)
$1N56728: R23.2 TP_SERVO_RST.1 U10.5(EN)

Not connected (* = marked no-connect by the designer): U3 8(NC)*; U5 2(PC13)* 3(PC14-OSC32_IN)* 4(PC15-OSC32_OUT)* 5(PF0-OSC_IN)* 6(PF1-OSC_OUT)* 18(PB2)* 33(PA11)* 34(PA12)* 43(PB6)*
